# EasyEDA schematic SCH_Nucleo扩展板_接口扩展_2022-11-04.json

## Sheets
1 连接器: TITLE: Sheet_1; REV: 1.0; Date: 2022-09-22; Sheet: 1/1; Company: Your Company
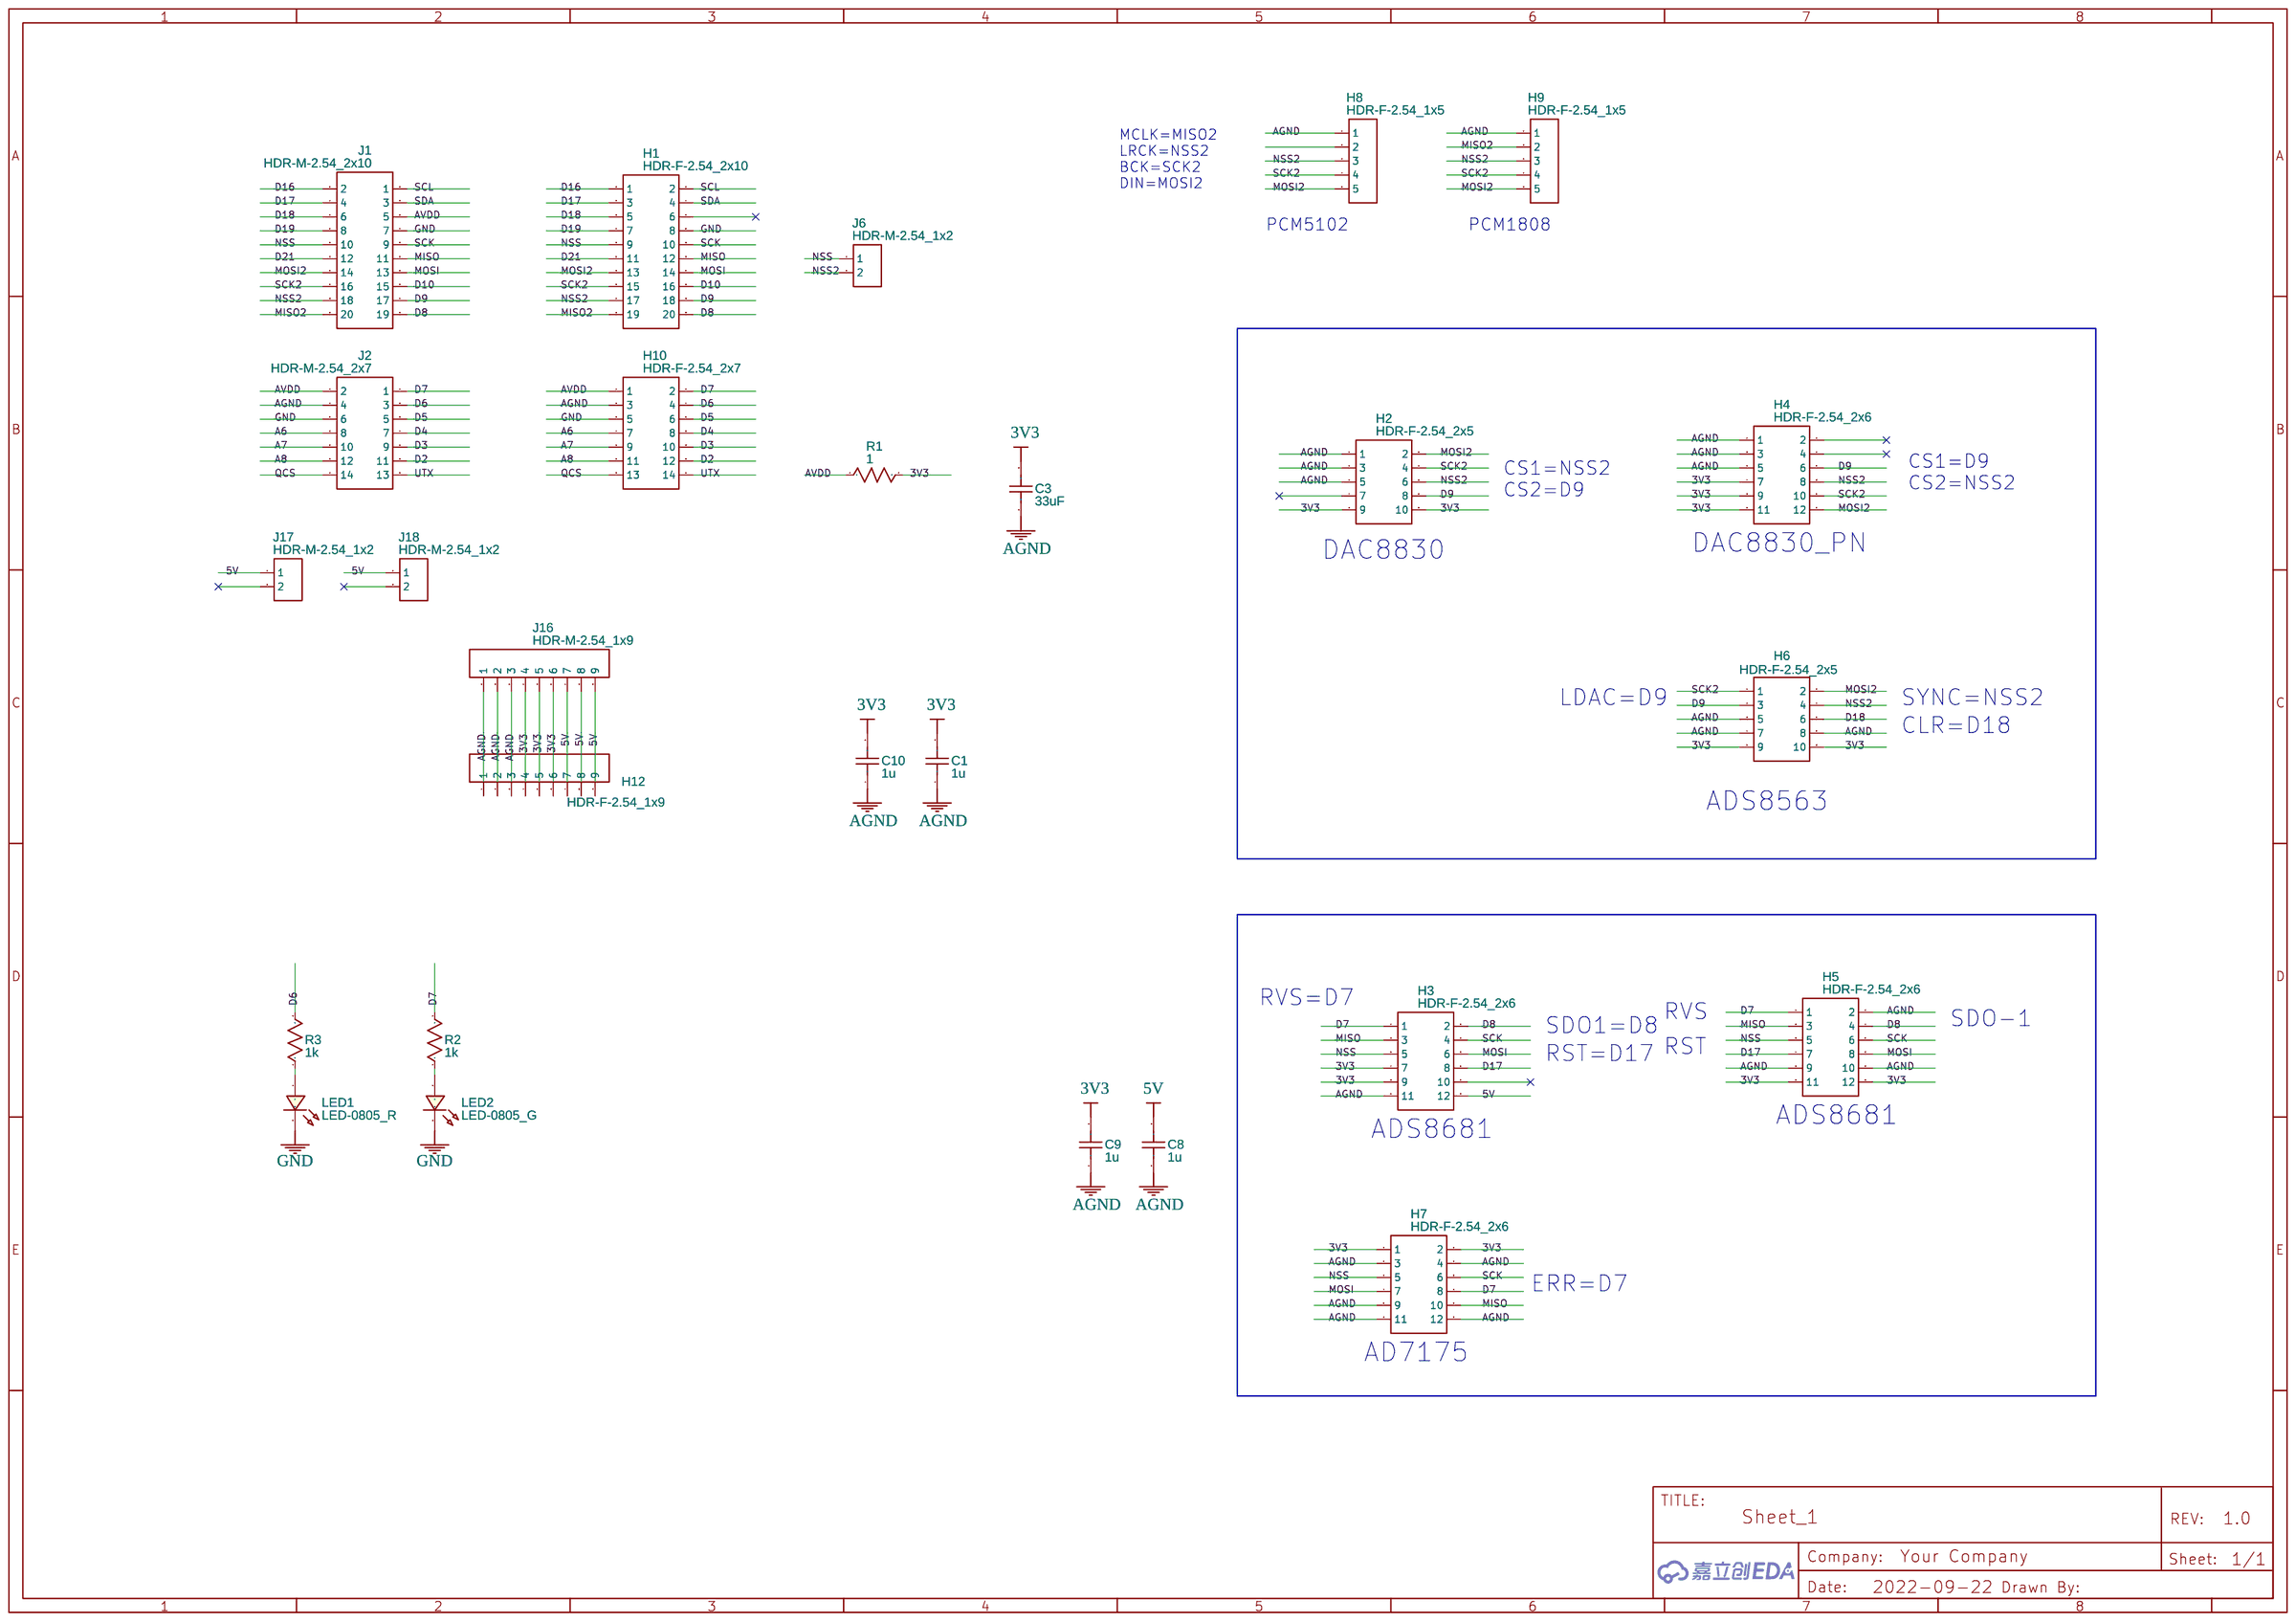
[diagram p0: 连接器]
2 连接器2: Date: 2022-11-04
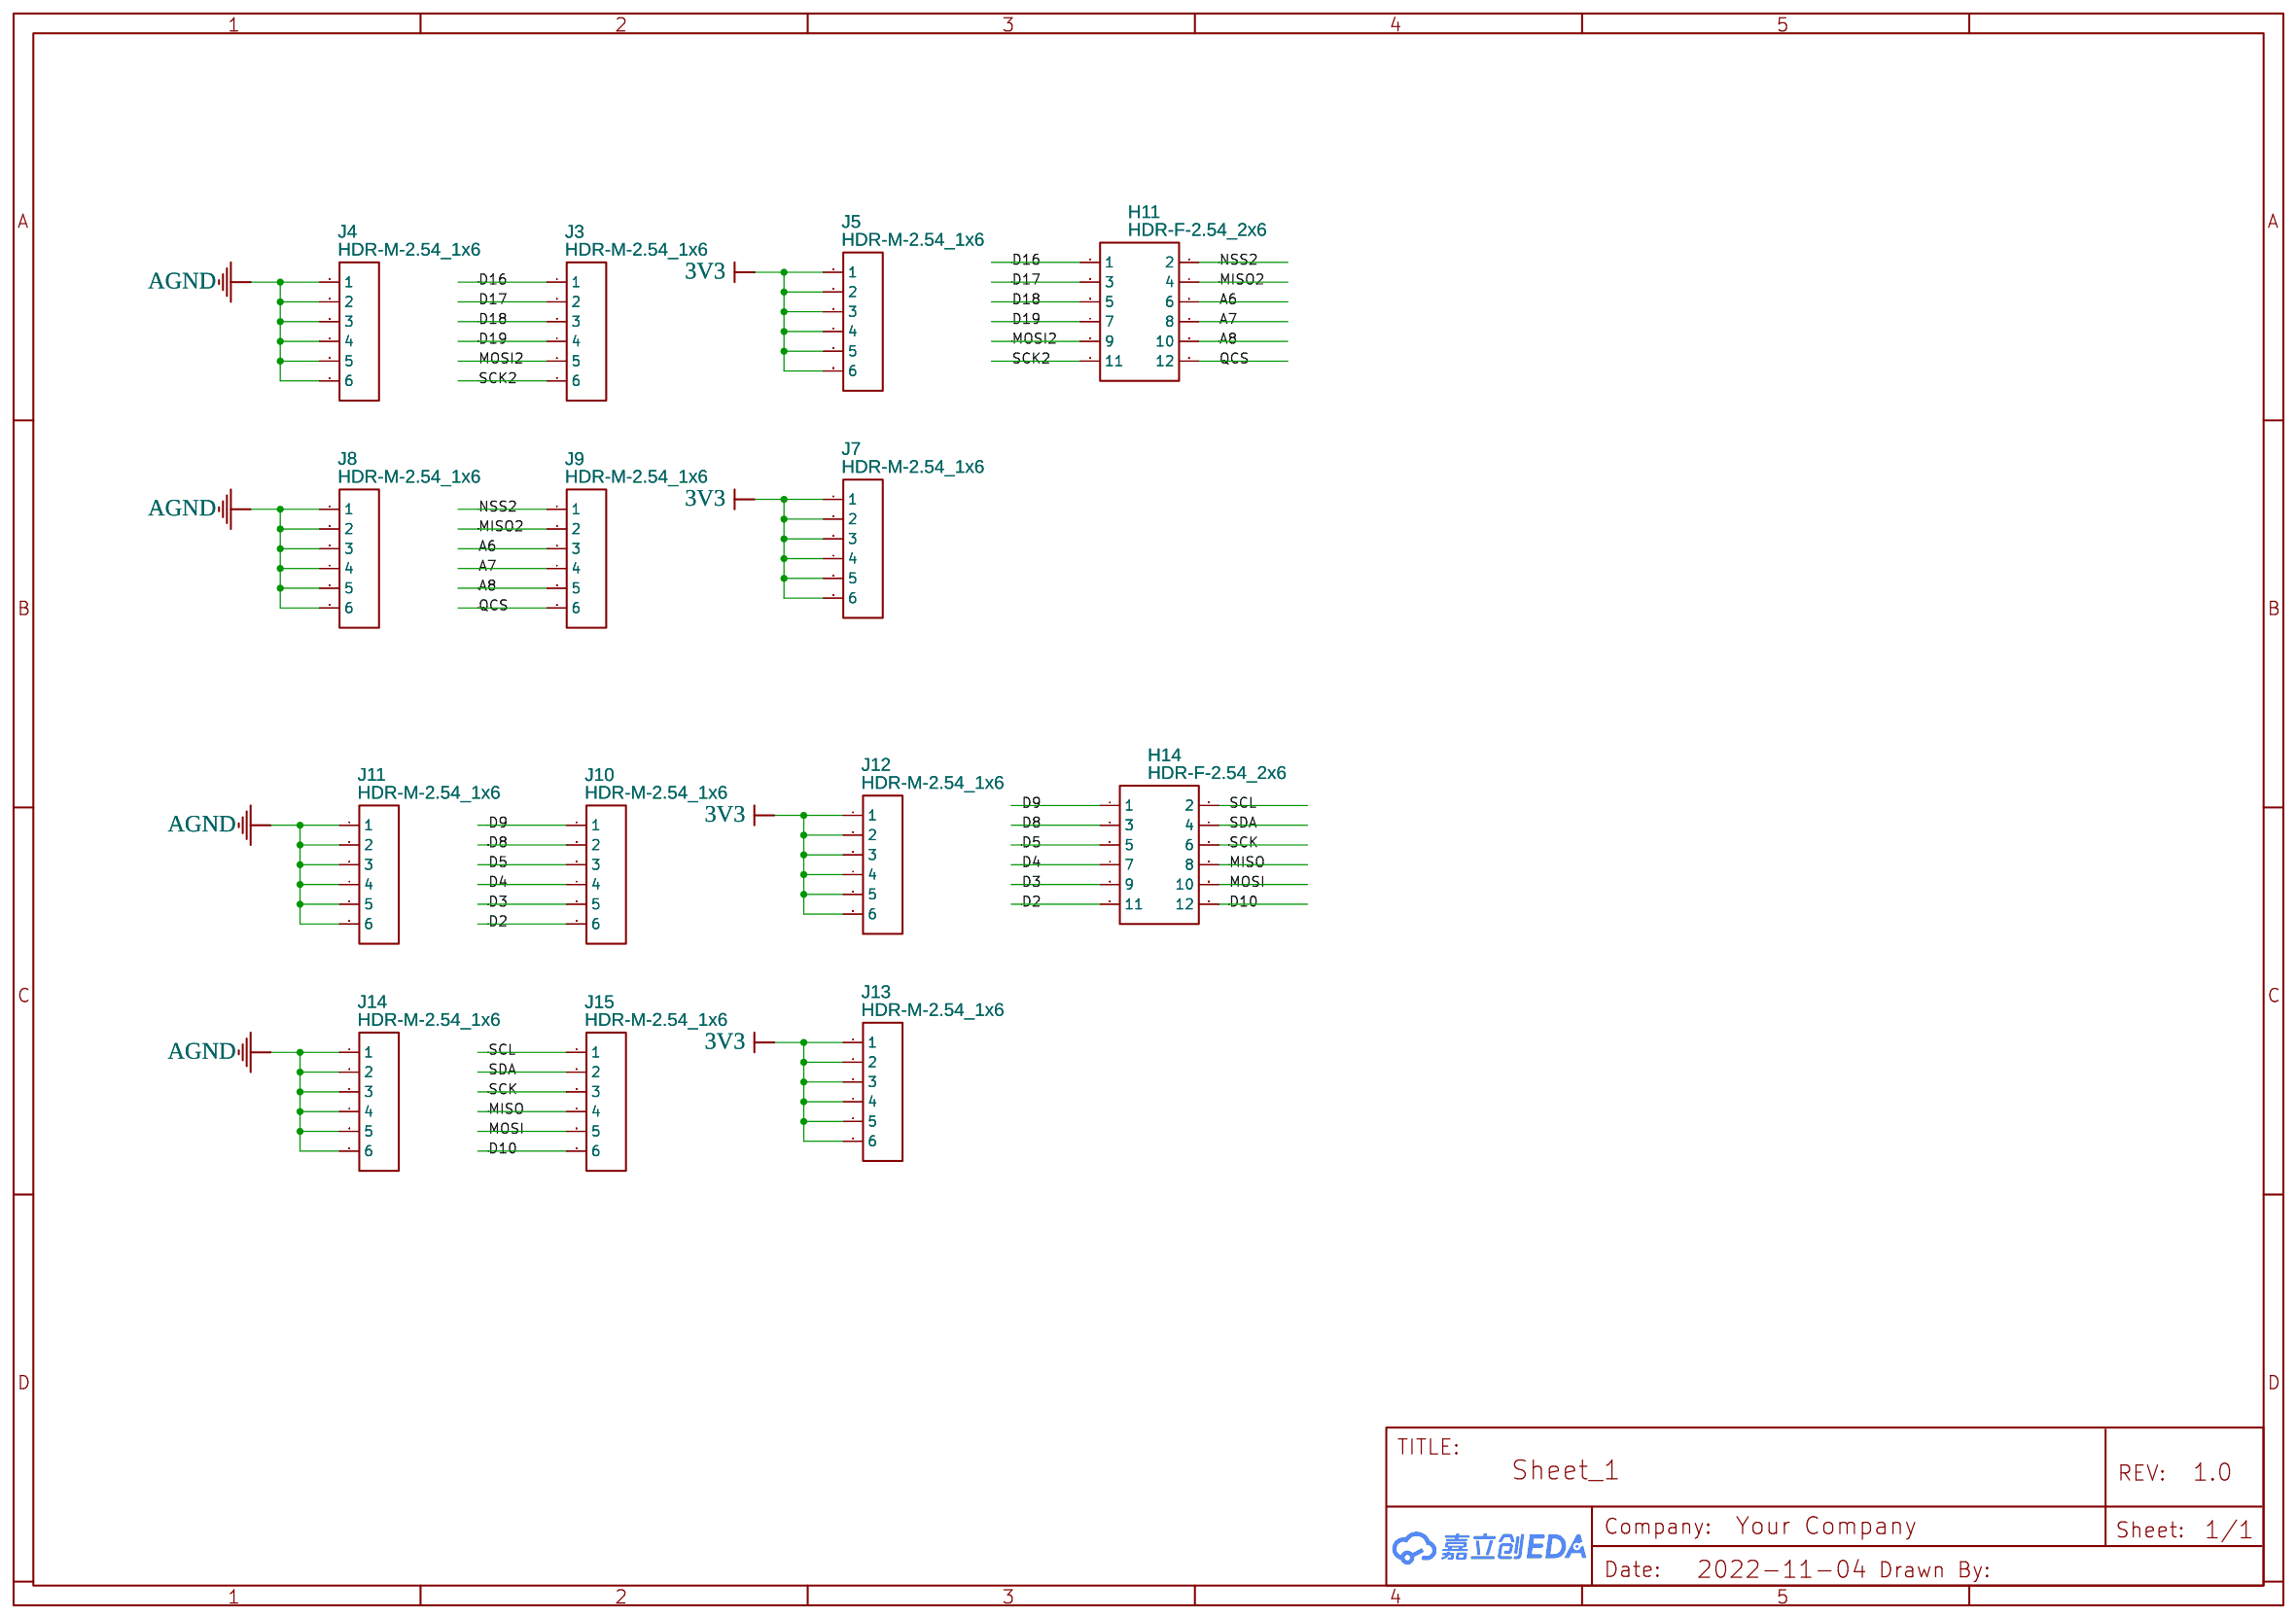
[diagram p1: 连接器2]

## Parts
sheet 连接器2
H11  HDR-F-2.54_2x6  [HDR-F-2.54_2X6]
H14  HDR-F-2.54_2x6  [HDR-F-2.54_2X6]
J3  HDR-M-2.54_1x6  [HDR-M-2.54_1X6]
J4  HDR-M-2.54_1x6  [HDR-M-2.54_1X6]
J5  HDR-M-2.54_1x6  [HDR-M-2.54_1X6]
J7  HDR-M-2.54_1x6  [HDR-M-2.54_1X6]
J8  HDR-M-2.54_1x6  [HDR-M-2.54_1X6]
J9  HDR-M-2.54_1x6  [HDR-M-2.54_1X6]
J10  HDR-M-2.54_1x6  [HDR-M-2.54_1X6]
J11  HDR-M-2.54_1x6  [HDR-M-2.54_1X6]
J12  HDR-M-2.54_1x6  [HDR-M-2.54_1X6]
J13  HDR-M-2.54_1x6  [HDR-M-2.54_1X6]
J14  HDR-M-2.54_1x6  [HDR-M-2.54_1X6]
J15  HDR-M-2.54_1x6  [HDR-M-2.54_1X6]
sheet 连接器
C1  1u  [C0805]
C3  33uF  [C1210]
C8  1u  [C0805]
C9  1u  [C0805]
C10  1u  [C0805]
H1  HDR-F-2.54_2x10  [HDR-F-2.54_2X10]
H2  HDR-F-2.54_2x5  [HDR-F-2.54_2X5]
H3  HDR-F-2.54_2x6  [HDR-F-2.54_2X6]
H4  HDR-F-2.54_2x6  [HDR-F-2.54_2X6]
H5  HDR-F-2.54_2x6  [HDR-F-2.54_2X6]
H6  HDR-F-2.54_2x5  [HDR-F-2.54_2X5]
H7  HDR-F-2.54_2x6  [HDR-F-2.54_2X6]
H8  HDR-F-2.54_1x5  [HDR-F-2.54_1X5]
H9  HDR-F-2.54_1x5  [HDR-F-2.54_1X5]
H10  HDR-F-2.54_2x7  [HDR-F-2.54_2X7]
H12  HDR-F-2.54_1x9  [HDR-F-2.54_1X9]
J1  HDR-M-2.54_2x10  [HDR-M-2.54_2X10]
J2  HDR-M-2.54_2x7  [HDR-M-2.54_2X7]
J6  HDR-M-2.54_1x2  [HDR-M-2.54_1X2]
J16  HDR-M-2.54_1x9  [HDR-M-2.54_1X9]
J17  HDR-M-2.54_1x2  [HDR-M-2.54_1X2]
J18  HDR-M-2.54_1x2  [HDR-M-2.54_1X2]
LED1  LED-0805_R  [LED0805_RED]
LED2  LED-0805_G  [LED0805_GREEN]
R1  1  [R0805]
R2  1k  [R0805]
R3  1k  [R0805]

## Library data of the parts
H3-H5 H7 H11 H14 = HDR-F-2.54_2x6: Supplier Part: C36191; Supplier: LCSC; Contributor: LCEDA_Lib
J3-J5 J7-J15 = HDR-M-2.54_1x6: Supplier Part: C190819; Supplier: LCSC; Contributor: LCEDA_Lib
C1 C8-C10 = C_0805_US: Supplier Part: C2913555; Supplier: LCSC; Contributor: LCEDA_Lib; Manufacturer Part: 0805B105M500NT; Manufacturer: FH(风华)
C3 = C3225X5R0J336MT0A0N: Supplier: LCSC; Supplier Part: C695362; Manufacturer: TDK; Contributor: LCSC; JLCPCB Part Class: Extended Part
H1 = HDR-F-2.54_2x10: Supplier Part: C30867; Supplier: LCSC; Contributor: LCEDA_Lib
H2 H6 = HDR-F-2.54_2x5: Supplier Part: C30419; Supplier: LCSC; Contributor: LCEDA_Lib
H8 H9 = HDR-F-2.54_1x5: Supplier Part: C50950; Supplier: LCSC; Contributor: LCEDA_Lib
H10 = HDR-F-2.54_2x7: Supplier Part: C38844; Supplier: LCSC; Contributor: LCEDA_Lib
H12 = HDR-F-2.54_1x9: Supplier Part: C124417; Supplier: LCSC; Contributor: LCEDA_Lib
J1 = HDR-M-2.54_2x10: Supplier Part: C124359; Supplier: LCSC; Contributor: LCEDA_Lib
J2 = HDR-M-2.54_2x7: Supplier Part: C71397; Supplier: LCSC; Contributor: LCEDA_Lib
J6 J17 J18 = HDR-M-2.54_1x2: Supplier Part: C124375; Supplier: LCSC; Contributor: LCEDA_Lib
J16 = HDR-M-2.54_1x9: Supplier Part: C225484; Supplier: LCSC; Contributor: LCEDA_Lib
LED1 = LED-0805_R: Manufacturer: EVERLIGHT(台湾亿光); Manufacturer Part: 17-21SURC/S530-A3/TR8; Supplier Part: C72037; Contributor: LCEDA_Lib
LED2 = LED-0805_G: Manufacturer: 国星光电; Manufacturer Part: NCD0805G1; Supplier Part: C84260; Contributor: LCEDA_Lib
R1 = R_0805_US: Contributor: LCEDA_Lib
R2 R3 = R_0805_US: Supplier Part: C75781; Supplier: LCSC; Contributor: LCEDA_Lib; Manufacturer Part: TC0525F1001T5E; Manufacturer: UniOhm

## Nets
3V3: C1.2 C3.2 C9.2 C10.2 H2.9 H2.10 H3.7 H3.9 H4.7 H4.9 H4.11 H5.11 H5.12 H6.9 H6.10 H7.1 H7.2 H12.4 H12.5 H12.6 J5.1 J5.2 J5.3 J5.4 J5.5 J5.6 J7.1 J7.2 J7.3 J7.4 J7.5 J7.6 J12.1 J12.2 J12.3 J12.4 J12.5 J12.6 J13.1 J13.2 J13.3 J13.4 J13.5 J13.6 J16.4 J16.5 J16.6 R1.2
5V: C8.2 H3.12 H12.7 H12.8 H12.9 J16.7 J16.8 J16.9 J17.1 J18.1
AGND: C1.1 C3.1 C8.1 C9.1 C10.1 H2.1 H2.3 H2.5 H3.11 H4.1 H4.3 H4.5 H5.2 H5.9 H5.10 H6.5 H6.7 H6.8 H7.3 H7.4 H7.9 H7.11 H7.12 H8.1 H9.1 H10.3 H12.1 H12.2 H12.3 J2.4 J4.1 J4.2 J4.3 J4.4 J4.5 J4.6 J8.1 J8.2 J8.3 J8.4 J8.5 J8.6 J11.1 J11.2 J11.3 J11.4 J11.5 J11.6 J14.1 J14.2 J14.3 J14.4 J14.5 J14.6 J16.1 J16.2 J16.3
AVDD: H10.1 J1.5 J2.2 R1.1
GND: H1.8 H10.5 J1.7 J2.6 LED1.2 LED2.2
A6: H10.7 H11.6 J2.8 J9.3
A7: H10.9 H11.8 J2.10 J9.4
A8: H10.11 H11.10 J2.12 J9.5
D2: H10.12 H14.11 J2.11 J10.6
D3: H10.10 H14.9 J2.9 J10.5
D4: H10.8 H14.7 J2.7 J10.4
D5: H10.6 H14.5 J2.5 J10.3
D6: H10.4 J2.3 R3.2
D7: H3.1 H5.1 H7.8 H10.2 J2.1 R2.2
D8: H1.20 H3.2 H5.4 H14.3 J1.19 J10.2
D9: H1.18 H2.8 H4.6 H6.3 H14.1 J1.17 J10.1
D10: H1.16 H14.12 J1.15 J15.6
D16: H1.1 H11.1 J1.2 J3.1
D17: H1.3 H3.8 H5.7 H11.3 J1.4 J3.2
D18: H1.5 H6.6 H11.5 J1.6 J3.3
D19: H1.7 H11.7 J1.8 J3.4
D21: H1.11 J1.12
MISO: H1.12 H3.3 H5.3 H7.10 H14.8 J1.11 J15.4
MISO2: H1.19 H9.2 H11.4 J1.20 J9.2
MOSI: H1.14 H3.6 H5.8 H7.7 H14.10 J1.13 J15.5
MOSI2: H1.13 H2.2 H4.12 H6.2 H8.5 H9.5 H11.9 J1.14 J3.5
NSS: H1.9 H3.5 H5.5 H7.5 J1.10 J6.1
NSS2: H1.17 H2.6 H4.8 H6.4 H8.3 H9.3 H11.2 J1.18 J6.2 J9.1
QCS: H10.13 H11.12 J2.14 J9.6
SCK: H1.10 H3.4 H5.6 H7.6 H14.6 J1.9 J15.3
SCK2: H1.15 H2.4 H4.10 H6.1 H8.4 H9.4 H11.11 J1.16 J3.6
SCL: H1.2 H14.2 J1.1 J15.1
SDA: H1.4 H14.4 J1.3 J15.2
UTX: H10.14 J2.13
Net-(LED1-1): LED1.1 R3.1
Net-(LED2-1): LED2.1 R2.1

Not connected (* = marked no-connect by the designer): H1 6; H2 7; H3 10; H4 2 4; H8 2; J17 2; J18 2

## Notes on the sheets
sheet 1
- MCLK=MISO2
  LRCK=NSS2
  BCK=SCK2
  DIN=MOSI2
- PCM5102
- PCM1808
- CS1=D9
  CS2=NSS2
- CS1=NSS2
  CS2=D9
- DAC8830
- DAC8830_PN
- LDAC=D9
- SYNC=NSS2
- CLR=D18
- ADS8563
- RVS=D7
- RVS
- SDO1=D8
- SDO-1
- RST=D17
- RST
- ADS8681
- ADS8681
- ERR=D7
- AD7175
